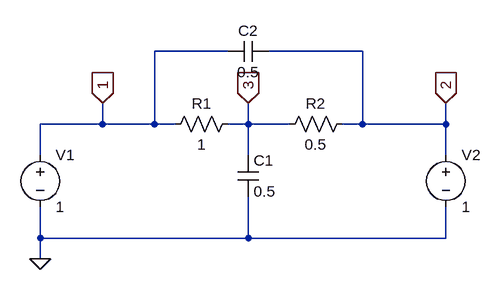
[diagram p0: schematic Two port circuit5.asc]
Two port circuit5.asc, the LTspice schematic file:
Version 4
SHEET 1 880 680
WIRE 160 -32 48 -32
WIRE 368 -32 224 -32
WIRE -32 80 -32 48
WIRE -32 80 -128 80
WIRE 48 80 48 -32
WIRE 48 80 -32 80
WIRE 80 80 48 80
WIRE 192 80 192 48
WIRE 192 80 160 80
WIRE 256 80 192 80
WIRE 368 80 368 -32
WIRE 368 80 336 80
WIRE 496 80 496 48
WIRE 496 80 368 80
WIRE -128 128 -128 80
WIRE 192 128 192 80
WIRE 496 128 496 80
WIRE -128 256 -128 208
WIRE 192 256 192 192
WIRE 192 256 -128 256
WIRE 496 256 192 256
WIRE 496 256 496 208
WIRE -128 288 -128 256
FLAG -128 288 0
FLAG 192 48 3
IOPIN 192 48 In
FLAG -32 48 1
IOPIN -32 48 In
FLAG 496 48 2
IOPIN 496 48 In
SYMBOL voltage -128 112 R0
WINDOW 123 0 0 Left 2
WINDOW 39 0 0 Left 2
SYMATTR InstName V1
SYMATTR Value 1
SYMBOL voltage 496 112 R0
WINDOW 123 0 0 Left 2
WINDOW 39 0 0 Left 2
SYMATTR InstName V2
SYMATTR Value 1
SYMBOL res 64 96 R270
WINDOW 0 32 56 VTop 2
WINDOW 3 0 56 VBottom 2
SYMATTR InstName R1
SYMATTR Value 1
SYMBOL res 240 96 R270
WINDOW 0 32 56 VTop 2
WINDOW 3 0 56 VBottom 2
SYMATTR InstName R2
SYMATTR Value 0.5
SYMBOL cap 176 128 R0
SYMATTR InstName C1
SYMATTR Value 0.5
SYMBOL cap 160 -16 R270
WINDOW 0 32 32 VTop 2
WINDOW 3 0 32 VBottom 2
SYMATTR InstName C2
SYMATTR Value 0.5

The netlist it stands for:
* Two port circuit5.asc
V1 1 0 1
V2 2 0 1
R1 1 3 1
R2 3 2 0.5
C1 3 0 0.5
C2 1 2 0.5
.backanno
.end